# EAGLE design POWER SUPPLY 5VDC (EAGLE 9.6.2)
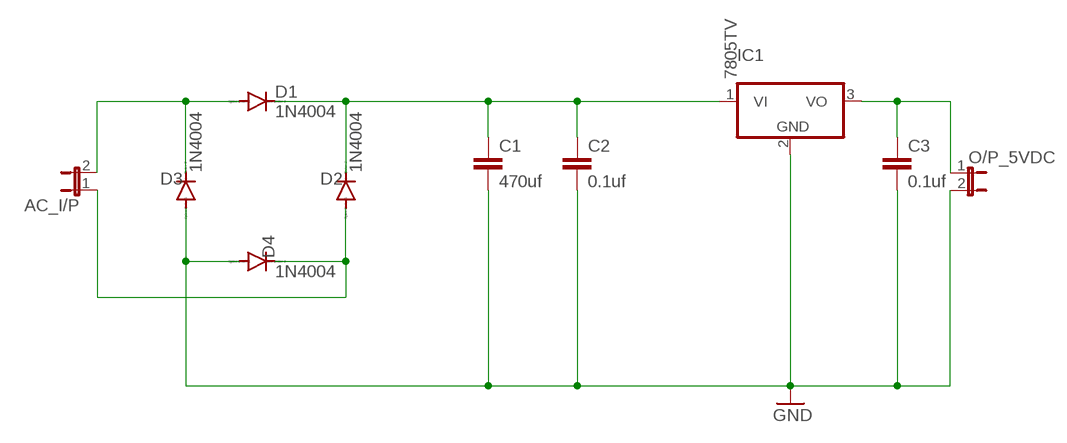
[diagram p0: schematic, sheet 1]

## Parts
AC_I/P  12VAC  JP1E  [JP1]
C1  470uf  C-EU025-024X044  [C025-024X044]
C2  0.1uf  C-EU025-024X044  [C025-024X044]
C3  0.1uf  C-EU025-024X044  [C025-024X044]
D1  1N4004  [DO41-10]
D2  1N4004  [DO41-10]
D3  1N4004  [DO41-10]
D4  1N4004  [DO41-10]
IC1  7805TV  [TO220V]
O/P_5VDC  5VDC  JP1E  [JP1]

## Nets
GND: C1.2 C2.2 C3.2 D3.A D4.A IC1.2(GND) O/P_5VDC.2
N$1: AC_I/P.2 D1.A D3.C
N$2: C1.1 C2.1 D1.C D2.C IC1.1(VI)
N$3: C3.1 IC1.3(VO) O/P_5VDC.1
N$5: AC_I/P.1 D2.A D4.C

## Library data of the parts
AC_I/P O/P_5VDC = jumper:JP1E: JUMPER
C1-C3 = rcl:C-EU: CAPACITOR, European symbol; SPICEPREFIX: C
D1-D4 = diode:1N4004: DIODE general purpose rectifier, 1 A
IC1 = linear:78*: Positive VOLTAGE REGULATOR Source: http://cache.national.com/ds/LM/LM78L05.pdf http://www.fairchildsemi.com/ds/LM/LM7805.pdf

## Board
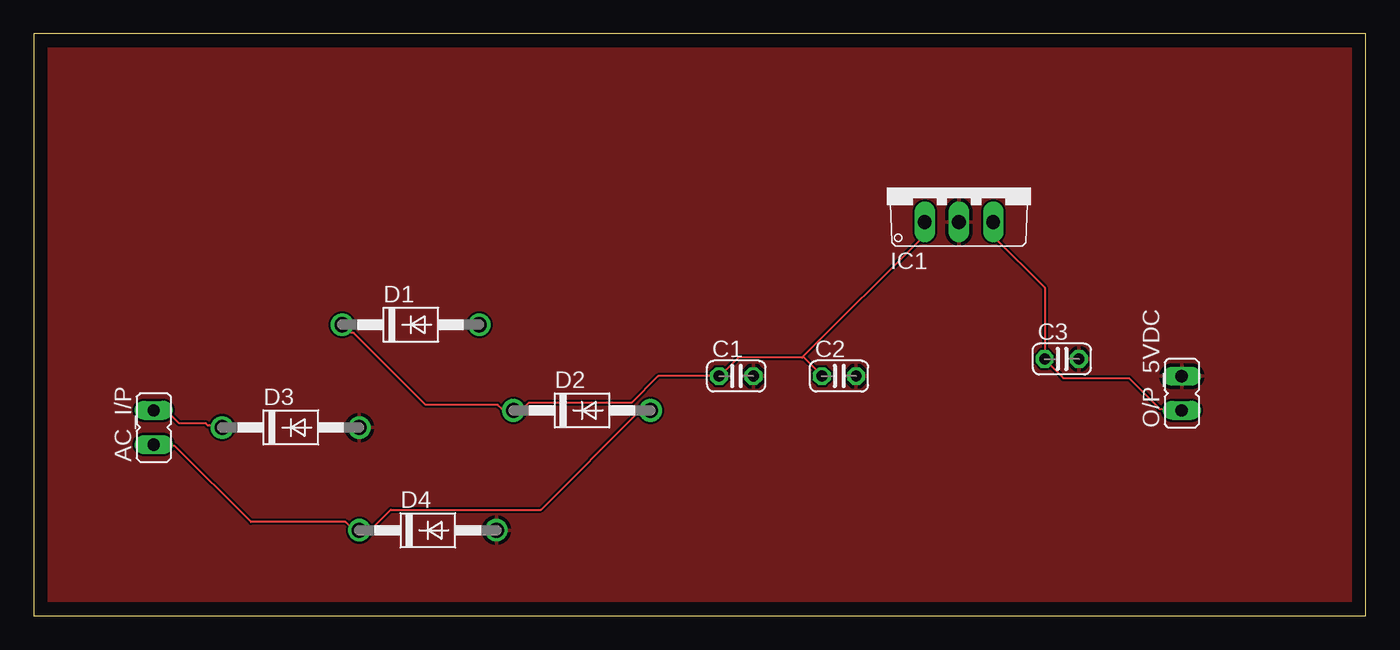
[diagram p1: board, top side]
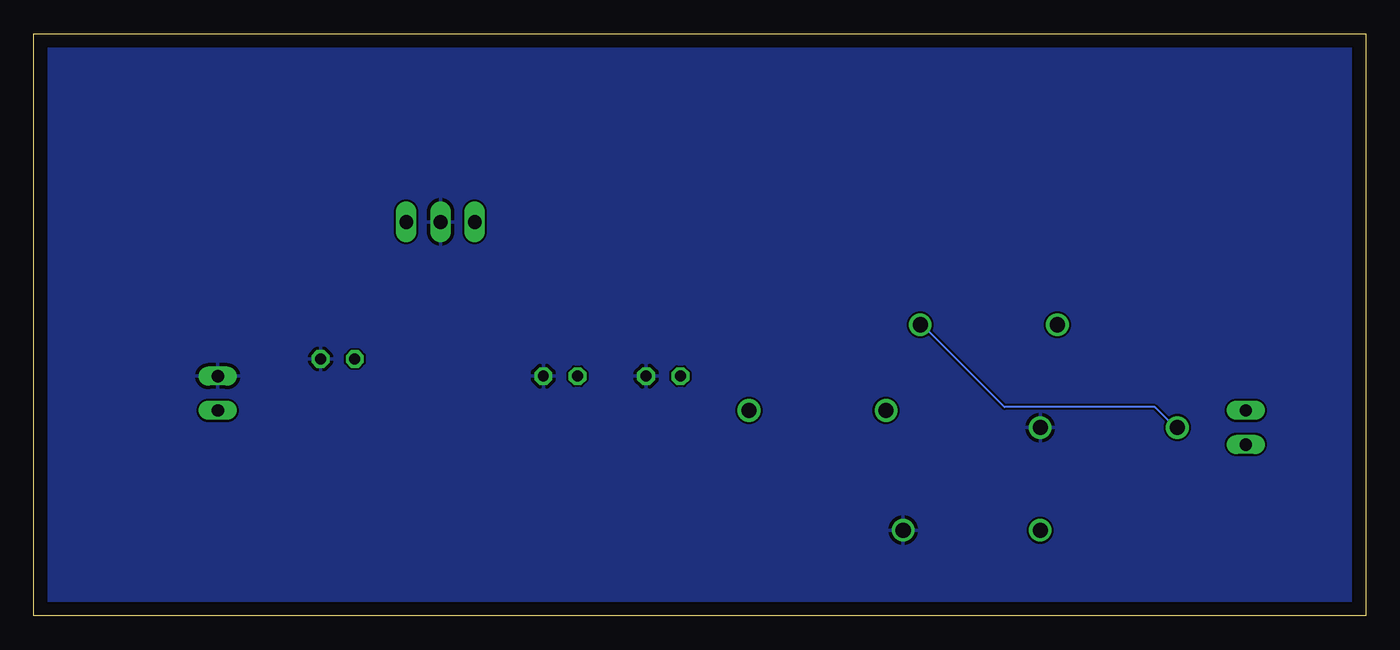
[diagram p2: board, bottom side, seen from below]

Size 98.73 x 43.17 mm. Coordinates in mm from the lower left corner, seen from the top.
Outline: 0,0 98.73,0 98.73,43.17 0,43.17 0,0
Copper layers (1*16): Top 0.035mm / dielectric 1.5mm / Bottom 0.035mm
Design rules "default": minimum track width 6mil, minimum drill 0.35mm, track to track 6mil, track to pad 6mil, pad to pad 6mil, via to via 6mil, smd to smd 6mil, copper to edge 40mil, drill to drill 6mil, minimum pad ring 10mil, minimum via ring 8mil, stop-mask expansion 4mil, vias tented up to drill 0mil, thermal gap 10mil

### Footprints (pad centres in the part's own frame; a part is rotated, then mirrored left to right if it is on the bottom)
JP1 = drill 0.914 long: 1 0,-1.27; 2 0,1.27
C025-024X044 = drill 0.813 octagon: 1 -1.27,0; 2 1.27,0
DO41-10 = drill 1.118: A 5.08,0; C -5.08,0
TO220V = drill 1.016 long: 1 -2.54,-2.54; 2 0,-2.54; 3 2.54,-2.54

### Placement (x,y rotation side)
AC_I/P  8.89,13.97 0 top
C1  52.07,17.78 0 top
C2  59.69,17.78 0 top
C3  76.2,19.05 0 top
D1  27.94,21.59 0 top
D2  40.64,15.24 0 top
D3  19.05,13.97 0 top
D4  29.21,6.35 0 top
IC1  68.58,31.75 0 top
O/P_5VDC  85.09,16.51 0 top

### Tracks (layer width: path | path; a pad name or v marks a point on that pad's centre or on a via)
GND
  pour Top: -3.81,44.45 99.06,44.45 100.33,43.18 100.33,-2.54 -5.08,-2.54 -5.08,43.18
  pour Bottom: -7.62,45.72 101.6,45.72 101.6,-2.54 101.6,-6.35 -13.97,-6.35 -15.24,-5.08 -15.24,38.1
N$1
  Top 0.152: D3.C 13.21,13.97 13.06,14.12 12.9,14.12 12.75,14.28 10.77,14.28 9.86,15.19 8.94,15.19 AC_I/P.2
  Bottom 0.152: D1.A 32.56,21.13 32.41,21.13 26.77,15.49 15.65,15.49 14.12,13.97 D3.C
N$2
  Top 0.152: D1.C 22.96,21.59 23.57,20.98 23.72,20.98 29.06,15.65 34.39,15.65 34.7,15.34 35.46,15.34 D2.C 35.61,15.34 36.22,15.34 36.68,15.8 44.3,15.8 46.28,17.78 C1.1 50.85,17.78 52.22,19.15 56.95,19.15 | 56.95,19.15 57.1,19.15 58.47,17.78 C2.1 | 56.95,19.15 65.94,28.14 65.94,29.21 IC1.1
N$3
  Top 0.152: IC1.3 71.12,28.14 74.93,24.33 C3.1 74.93,19 76.3,17.63 81.18,17.63 83.46,15.34 84.99,15.34 O/P_5VDC.1
N$5
  Top 0.152: AC_I/P.1 8.94,12.6 10.46,12.6 16.1,6.96 23.11,6.96 23.72,6.35 D4.C 24.94,6.35 26.47,7.87 37.59,7.87 44.91,15.19 45.67,15.19 D2.A